# Altium schematic sheet MCU.SchDoc
size A2
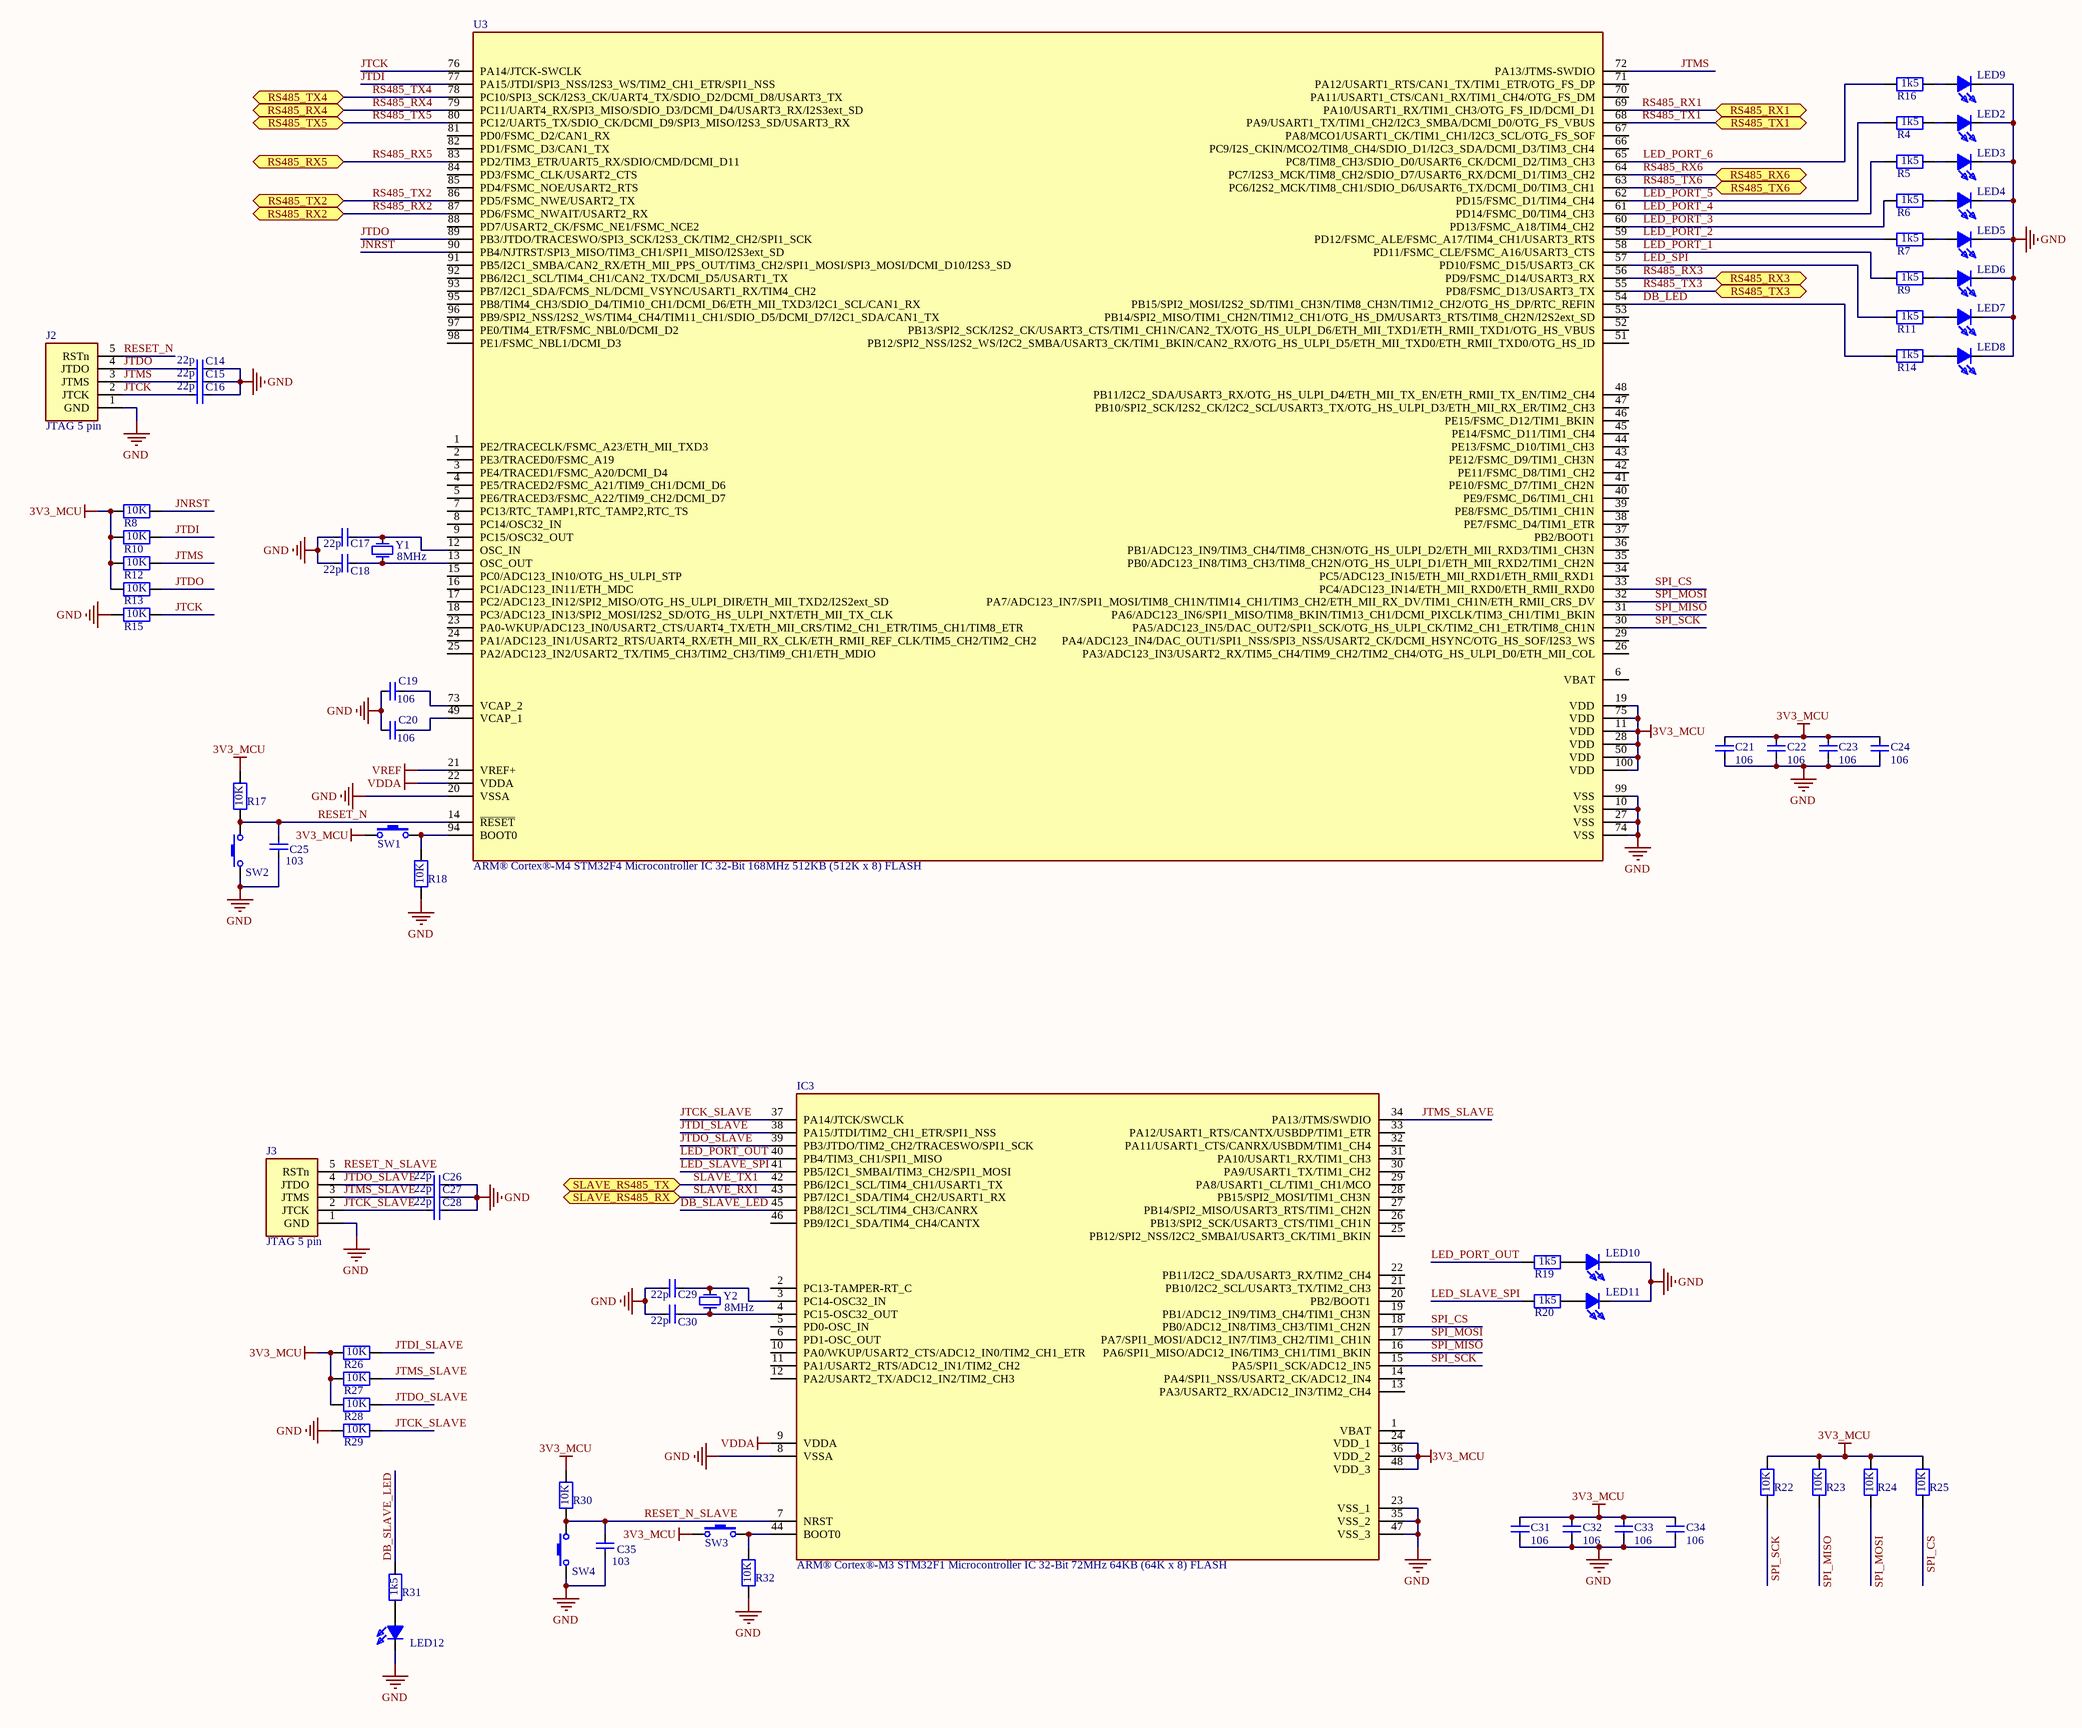
[diagram p0: MCU.SchDoc]

## Parts
C14  22p  [CAPC1608X95N]
C15  22p  [CAPC1608X95N]
C16  22p  [CAPC1608X95N]
C17  22p  [CAPC1608X95N]
C18  22p  [CAPC1608X95N]
C19  106  [CAPC1608X95N]
C20  106  [CAPC1608X95N]
C21  106  [CAPC1608X95N]
C22  106  [CAPC1608X95N]
C23  106  [CAPC1608X95N]
C24  106  [CAPC1608X95N]
C25  103  [CAPC1608X95N]
C26  22p  [CAPC1608X95N]
C27  22p  [CAPC1608X95N]
C28  22p  [CAPC1608X95N]
C29  22p  [CAPC1608X95N]
C30  22p  [CAPC1608X95N]
C31  106  [CAPC1608X95N]
C32  106  [CAPC1608X95N]
C33  106  [CAPC1608X95N]
C34  106  [CAPC1608X95N]
C35  103  [CAPC1608X95N]
IC3  ARM® Cortex®-M3 STM32F1 Microcontroller IC 32-Bit 72MHz 64KB (64K x 8) FLASH  [QFP50P900X900X160-48N]
J2  JTAG 5 pin  [HDRV5W66P0X254_1X5_1270X249X1067P]
J3  JTAG 5 pin  [HDRV5W66P0X254_1X5_1270X249X1067P]
LED2  LED0603_BLUE  [LEDC1608X80N]  (value not drawn)
LED3  LED0603_BLUE  [LEDC1608X80N]  (value not drawn)
LED4  LED0603_BLUE  [LEDC1608X80N]  (value not drawn)
LED5  LED0603_BLUE  [LEDC1608X80N]  (value not drawn)
LED6  LED0603_BLUE  [LEDC1608X80N]  (value not drawn)
LED7  LED0603_BLUE  [LEDC1608X80N]  (value not drawn)
LED8  LED0603_BLUE  [LEDC1608X80N]  (value not drawn)
LED9  LED0603_BLUE  [LEDC1608X80N]  (value not drawn)
LED10  LED0603_BLUE  [LEDC1608X80N]  (value not drawn)
LED11  LED0603_BLUE  [LEDC1608X80N]  (value not drawn)
LED12  LED0603_BLUE  [LEDC1608X80N]  (value not drawn)
R4  Res 0603 1k5  [RESC1608X55N]  (value not drawn)
R5  Res 0603 1k5  [RESC1608X55N]  (value not drawn)
R6  Res 0603 1k5  [RESC1608X55N]  (value not drawn)
R7  Res 0603 1k5  [RESC1608X55N]  (value not drawn)
R8  10k  [RESC1608X55N]  (value not drawn)
R9  Res 0603 1k5  [RESC1608X55N]  (value not drawn)
R10  10k  [RESC1608X55N]  (value not drawn)
R11  Res 0603 1k5  [RESC1608X55N]  (value not drawn)
R12  10k  [RESC1608X55N]  (value not drawn)
R13  10k  [RESC1608X55N]  (value not drawn)
R14  Res 0603 1k5  [RESC1608X55N]  (value not drawn)
R15  10k  [RESC1608X55N]  (value not drawn)
R16  Res 0603 1k5  [RESC1608X55N]  (value not drawn)
R17  10k  [RESC1608X55N]  (value not drawn)
R18  10k  [RESC1608X55N]  (value not drawn)
R19  Res 0603 1k5  [RESC1608X55N]  (value not drawn)
R20  Res 0603 1k5  [RESC1608X55N]  (value not drawn)
R22  10k  [RESC1608X55N]  (value not drawn)
R23  10k  [RESC1608X55N]  (value not drawn)
R24  10k  [RESC1608X55N]  (value not drawn)
R25  10k  [RESC1608X55N]  (value not drawn)
R26  10k  [RESC1608X55N]  (value not drawn)
R27  10k  [RESC1608X55N]  (value not drawn)
R28  10k  [RESC1608X55N]  (value not drawn)
R29  10k  [RESC1608X55N]  (value not drawn)
R30  10k  [RESC1608X55N]  (value not drawn)
R31  Res 0603 1k5  [RESC1608X55N]  (value not drawn)
R32  10k  [RESC1608X55N]  (value not drawn)
SW1  Switch SMD 2 pin  [RS282G05A3SMRT]  (value not drawn)
SW2  Switch SMD 2 pin  [RS282G05A3SMRT]  (value not drawn)
SW3  Switch SMD 2 pin  [RS282G05A3SMRT]  (value not drawn)
SW4  Switch SMD 2 pin  [RS282G05A3SMRT]  (value not drawn)
U3  ARM® Cortex®-M4 STM32F4 Microcontroller IC 32-Bit 168MHz 512KB (512K x 8) FLASH  [QFP50P1600X1600X160-100N]
Y1  8MHz  [F90800018Q]
Y2  8MHz  [F90800018Q]

## Ports
RS485_RX1 (bidir), RS485_RX2 (bidir), RS485_RX3 (bidir), RS485_RX4 (bidir), RS485_RX5 (bidir), RS485_RX6 (bidir), RS485_TX1 (bidir), RS485_TX2 (bidir), RS485_TX3 (bidir), RS485_TX4 (bidir), RS485_TX5 (bidir), RS485_TX6 (bidir), SLAVE_RS485_RX (bidir), SLAVE_RS485_TX (bidir)

## Nets
3V3_MCU: C21.2 C22.2 C23.2 C24.2 C31.2 C32.2 C33.2 C34.2 IC3.24(VDD_1) IC3.36(VDD_2) IC3.48(VDD_3) R8.1 R10.1 R12.1 R13.1 R17.2 R22.2 R23.2 R24.2 R25.2 R26.1 R27.1 R28.1 R30.2 SW1.P1(COM1) SW3.P1(COM1) U3.11(VDD) U3.19(VDD) U3.28(VDD) U3.50(VDD) U3.75(VDD) U3.100(VDD)
GND: C14.2 C15.2 C16.2 C17.1 C18.1 C19.1 C20.1 C21.1 C22.1 C23.1 C24.1 C25.1 C26.2 C27.2 C28.2 C29.1 C30.1 C31.1 C32.1 C33.1 C34.1 C35.1 IC3.8(VSSA) IC3.23(VSS_1) IC3.35(VSS_2) IC3.47(VSS_3) J2.1(GND) J3.1(GND) LED2.1(K) LED3.1(K) LED4.1(K) LED5.1(K) LED6.1(K) LED7.1(K) LED8.1(K) LED9.1(K) LED10.1(K) LED11.1(K) LED12.1(K) R15.1 R18.1 R29.1 R32.1 SW2.P1(COM1) SW4.P1(COM1) U3.10(VSS) U3.20(VSSA) U3.27(VSS) U3.74(VSS) U3.99(VSS)
VDDA: IC3.9(VDDA) U3.22(VDDA)
VREF: U3.21(VREF+)
DB_LED: R14.1 U3.54(PB15/SPI2_MOSI/I2S2_SD/TIM1_CH3N/TIM8_CH3N/TIM12_CH2/OTG_HS_DP/RTC_REFIN)
DB_SLAVE_LED: IC3.45(PB8/I2C1_SCL/TIM4_CH3/CANRX) R31.2
JNRST: R8.2 U3.90(PB4/NJTRST/SPI3_MISO/TIM3_CH1/SPI1_MISO/I2S3ext_SD)
JTCK: C16.1 J2.2(JTCK) R15.2 U3.76(PA14/JTCK-SWCLK)
JTCK_SLAVE: C28.1 IC3.37(PA14/JTCK/SWCLK) J3.2(JTCK) R29.2
JTDI: R10.2 U3.77(PA15/JTDI/SPI3_NSS/I2S3_WS/TIM2_CH1_ETR/SPI1_NSS)
JTDI_SLAVE: IC3.38(PA15/JTDI/TIM2_CH1_ETR/SPI1_NSS) R26.2
JTDO: C14.1 J2.4(JTDO) R13.2 U3.89(PB3/JTDO/TRACESWO/SPI3_SCK/I2S3_CK/TIM2_CH2/SPI1_SCK)
JTDO_SLAVE: C26.1 IC3.39(PB3/JTDO/TIM2_CH2/TRACESWO/SPI1_SCK) J3.4(JTDO) R28.2
JTMS: C15.1 J2.3(JTMS) R12.2 U3.72(PA13/JTMS-SWDIO)
JTMS_SLAVE: C27.1 IC3.34(PA13/JTMS/SWDIO) J3.3(JTMS) R27.2
LED_PORT_1: R9.1 U3.58(PD11/FSMC_CLE/FSMC_A16/USART3_CTS)
LED_PORT_2: R7.1 U3.59(PD12/FSMC_ALE/FSMC_A17/TIM4_CH1/USART3_RTS)
LED_PORT_3: R6.1 U3.60(PD13/FSMC_A18/TIM4_CH2)
LED_PORT_4: R5.1 U3.61(PD14/FSMC_D0/TIM4_CH3)
LED_PORT_5: R4.1 U3.62(PD15/FSMC_D1/TIM4_CH4)
LED_PORT_6: R16.1 U3.65(PC8/TIM8_CH3/SDIO_D0/USART6_CK/DCMI_D2/TIM3_CH3)
LED_PORT_OUT: IC3.40(PB4/TIM3_CH1/SPI1_MISO) R19.1
LED_SLAVE_SPI: IC3.41(PB5/I2C1_SMBAI/TIM3_CH2/SPI1_MOSI) R20.1
LED_SPI: R11.1 U3.57(PD10/FSMC_D15/USART3_CK)
RESET_N: C25.2 J2.5(RSTn) R17.1 SW2.T1(COM2) U3.14(~{RESET})
RESET_N_SLAVE: C35.2 IC3.7(NRST) J3.5(RSTn) R30.1 SW4.T1(COM2)
RS485_RX1: U3.69(PA10/USART1_RX/TIM1_CH3/OTG_FS_ID/DCMI_D1) ; port RS485_RX1
RS485_RX2: U3.87(PD6/FSMC_NWAIT/USART2_RX) ; port RS485_RX2
RS485_RX3: U3.56(PD9/FSMC_D14/USART3_RX) ; port RS485_RX3
RS485_RX4: U3.79(PC11/UART4_RX/SPI3_MISO/SDIO_D3/DCMI_D4/USART3_RX/I2S3ext_SD) ; port RS485_RX4
RS485_RX5: U3.83(PD2/TIM3_ETR/UART5_RX/SDIO/CMD/DCMI_D11) ; port RS485_RX5
RS485_RX6: U3.64(PC7/I2S3_MCK/TIM8_CH2/SDIO_D7/USART6_RX/DCMI_D1/TIM3_CH2) ; port RS485_RX6
RS485_TX1: U3.68(PA9/USART1_TX/TIM1_CH2/I2C3_SMBA/DCMI_D0/OTG_FS_VBUS) ; port RS485_TX1
RS485_TX2: U3.86(PD5/FSMC_NWE/USART2_TX) ; port RS485_TX2
RS485_TX3: U3.55(PD8/FSMC_D13/USART3_TX) ; port RS485_TX3
RS485_TX4: U3.78(PC10/SPI3_SCK/I2S3_CK/UART4_TX/SDIO_D2/DCMI_D8/USART3_TX) ; port RS485_TX4
RS485_TX5: U3.80(PC12/UART5_TX/SDIO_CK/DCMI_D9/SPI3_MISO/I2S3_SD/USART3_RX) ; port RS485_TX5
RS485_TX6: U3.63(PC6/I2S2_MCK/TIM8_CH1/SDIO_D6/USART6_TX/DCMI_D0/TIM3_CH1) ; port RS485_TX6
SLAVE_RX1: IC3.43(PB7/I2C1_SDA/TIM4_CH2/USART1_RX) ; port SLAVE_RS485_RX
SLAVE_TX1: IC3.42(PB6/I2C1_SCL/TIM4_CH1/USART1_TX) ; port SLAVE_RS485_TX
SPI_CS: IC3.18(PB0/ADC12_IN8/TIM3_CH3/TIM1_CH2N) R25.1 U3.33(PC4/ADC123_IN14/ETH_MII_RXD0/ETH_RMII_RXD0)
SPI_MISO: IC3.16(PA6/SPI1_MISO/ADC12_IN6/TIM3_CH1/TIM1_BKIN) R23.1 U3.31(PA6/ADC123_IN6/SPI1_MISO/TIM8_BKIN/TIM13_CH1/DCMI_PIXCLK/TIM3_CH1/TIM1_BKIN)
SPI_MOSI: IC3.17(PA7/SPI1_MOSI/ADC12_IN7/TIM3_CH2/TIM1_CH1N) R24.1 U3.32(PA7/ADC123_IN7/SPI1_MOSI/TIM8_CH1N/TIM14_CH1/TIM3_CH2/ETH_MII_RX_DV/TIM1_CH1N/ETH_RMII_CRS_DV)
SPI_SCK: IC3.15(PA5/SPI1_SCK/ADC12_IN5) R22.1 U3.30(PA5/ADC123_IN5/DAC_OUT2/SPI1_SCK/OTG_HS_ULPI_CK/TIM2_CH1_ETR/TIM8_CH1N)
NetC17_2: C17.2 U3.12(OSC_IN) Y1.1(CRYSTAL_1)
NetC18_2: C18.2 U3.13(OSC_OUT) Y1.2(CRYSTAL_2)
NetC19_2: C19.2 U3.73(VCAP_2)
NetC20_2: C20.2 U3.49(VCAP_1)
NetC29_2: C29.2 IC3.3(PC14-OSC32_IN) Y2.1(CRYSTAL_1)
NetC30_2: C30.2 IC3.4(PC15-OSC32_OUT) Y2.2(CRYSTAL_2)
NetIC3_44: IC3.44(BOOT0) R32.2 SW3.T1(COM2)
NetLED2_2: LED2.2(A) R4.2
NetLED3_2: LED3.2(A) R5.2
NetLED4_2: LED4.2(A) R6.2
NetLED5_2: LED5.2(A) R7.2
NetLED6_2: LED6.2(A) R9.2
NetLED7_2: LED7.2(A) R11.2
NetLED8_2: LED8.2(A) R14.2
NetLED9_2: LED9.2(A) R16.2
NetLED10_2: LED10.2(A) R19.2
NetLED11_2: LED11.2(A) R20.2
NetLED12_2: LED12.2(A) R31.1
NetR18_2: R18.2 SW1.T1(COM2) U3.94(BOOT0)

Not connected (* = marked no-connect by the designer): IC3 1(VBAT) 2(PC13-TAMPER-RT_C) 5(PD0-OSC_IN) 6(PD1-OSC_OUT) 10(PA0/WKUP/USART2_CTS/ADC12_IN0/TIM2_CH1_ETR) 11(PA1/USART2_RTS/ADC12_IN1/TIM2_CH2) 12(PA2/USART2_TX/ADC12_IN2/TIM2_CH3) 13(PA3/USART2_RX/ADC12_IN3/TIM2_CH4) 14(PA4/SPI1_NSS/USART2_CK/ADC12_IN4) 19(PB1/ADC12_IN9/TIM3_CH4/TIM1_CH3N) 20(PB2/BOOT1) 21(PB10/I2C2_SCL/USART3_TX/TIM2_CH3) 22(PB11/I2C2_SDA/USART3_RX/TIM2_CH4) 25(PB12/SPI2_NSS/I2C2_SMBAI/USART3_CK/TIM1_BKIN) 26(PB13/SPI2_SCK/USART3_CTS/TIM1_CH1N) 27(PB14/SPI2_MISO/USART3_RTS/TIM1_CH2N) 28(PB15/SPI2_MOSI/TIM1_CH3N) 29(PA8/USART1_CL/TIM1_CH1/MCO) 30(PA9/USART1_TX/TIM1_CH2) 31(PA10/USART1_RX/TIM1_CH3) 32(PA11/USART1_CTS/CANRX/USBDM/TIM1_CH4) 33(PA12/USART1_RTS/CANTX/USBDP/TIM1_ETR) 46(PB9/I2C1_SDA/TIM4_CH4/CANTX); U3 1(PE2/TRACECLK/FSMC_A23/ETH_MII_TXD3) 2(PE3/TRACED0/FSMC_A19) 3(PE4/TRACED1/FSMC_A20/DCMI_D4) 4(PE5/TRACED2/FSMC_A21/TIM9_CH1/DCMI_D6) 5(PE6/TRACED3/FSMC_A22/TIM9_CH2/DCMI_D7) 6(VBAT) 7(PC13/RTC_TAMP1,RTC_TAMP2,RTC_TS) 8(PC14/OSC32_IN) 9(PC15/OSC32_OUT) 15(PC0/ADC123_IN10/OTG_HS_ULPI_STP) 16(PC1/ADC123_IN11/ETH_MDC) 17(PC2/ADC123_IN12/SPI2_MISO/OTG_HS_ULPI_DIR/ETH_MII_TXD2/I2S2ext_SD) 18(PC3/ADC123_IN13/SPI2_MOSI/I2S2_SD/OTG_HS_ULPI_NXT/ETH_MII_TX_CLK) 23(PA0-WKUP/ADC123_IN0/USART2_CTS/UART4_TX/ETH_MII_CRS/TIM2_CH1_ETR/TIM5_CH1/TIM8_ETR) 24(PA1/ADC123_IN1/USART2_RTS/UART4_RX/ETH_MII_RX_CLK/ETH_RMII_REF_CLK/TIM5_CH2/TIM2_CH2) 25(PA2/ADC123_IN2/USART2_TX/TIM5_CH3/TIM2_CH3/TIM9_CH1/ETH_MDIO) 26(PA3/ADC123_IN3/USART2_RX/TIM5_CH4/TIM9_CH2/TIM2_CH4/OTG_HS_ULPI_D0/ETH_MII_COL) 29(PA4/ADC123_IN4/DAC_OUT1/SPI1_NSS/SPI3_NSS/USART2_CK/DCMI_HSYNC/OTG_HS_SOF/I2S3_WS) 34(PC5/ADC123_IN15/ETH_MII_RXD1/ETH_RMII_RXD1) 35(PB0/ADC123_IN8/TIM3_CH3/TIM8_CH2N/OTG_HS_ULPI_D1/ETH_MII_RXD2/TIM1_CH2N) 36(PB1/ADC123_IN9/TIM3_CH4/TIM8_CH3N/OTG_HS_ULPI_D2/ETH_MII_RXD3/TIM1_CH3N) 37(PB2/BOOT1) 38(PE7/FSMC_D4/TIM1_ETR) 39(PE8/FSMC_D5/TIM1_CH1N) 40(PE9/FSMC_D6/TIM1_CH1) 41(PE10/FSMC_D7/TIM1_CH2N) 42(PE11/FSMC_D8/TIM1_CH2) 43(PE12/FSMC_D9/TIM1_CH3N) 44(PE13/FSMC_D10/TIM1_CH3) 45(PE14/FSMC_D11/TIM1_CH4) 46(PE15/FSMC_D12/TIM1_BKIN) 47(PB10/SPI2_SCK/I2S2_CK/I2C2_SCL/USART3_TX/OTG_HS_ULPI_D3/ETH_MII_RX_ER/TIM2_CH3) 48(PB11/I2C2_SDA/USART3_RX/OTG_HS_ULPI_D4/ETH_MII_TX_EN/ETH_RMII_TX_EN/TIM2_CH4) 51(PB12/SPI2_NSS/I2S2_WS/I2C2_SMBA/USART3_CK/TIM1_BKIN/CAN2_RX/OTG_HS_ULPI_D5/ETH_MII_TXD0/ETH_RMII_TXD0/OTG_HS_ID) 52(PB13/SPI2_SCK/I2S2_CK/USART3_CTS/TIM1_CH1N/CAN2_TX/OTG_HS_ULPI_D6/ETH_MII_TXD1/ETH_RMII_TXD1/OTG_HS_VBUS) 53(PB14/SPI2_MISO/TIM1_CH2N/TIM12_CH1/OTG_HS_DM/USART3_RTS/TIM8_CH2N/I2S2ext_SD) 66(PC9/I2S_CKIN/MCO2/TIM8_CH4/SDIO_D1/I2C3_SDA/DCMI_D3/TIM3_CH4) 67(PA8/MCO1/USART1_CK/TIM1_CH1/I2C3_SCL/OTG_FS_SOF) 70(PA11/USART1_CTS/CAN1_RX/TIM1_CH4/OTG_FS_DM) 71(PA12/USART1_RTS/CAN1_TX/TIM1_ETR/OTG_FS_DP) 81(PD0/FSMC_D2/CAN1_RX) 82(PD1/FSMC_D3/CAN1_TX) 84(PD3/FSMC_CLK/USART2_CTS) 85(PD4/FSMC_NOE/USART2_RTS) 88(PD7/USART2_CK/FSMC_NE1/FSMC_NCE2) 91(PB5/I2C1_SMBA/CAN2_RX/ETH_MII_PPS_OUT/TIM3_CH2/SPI1_MOSI/SPI3_MOSI/DCMI_D10/I2S3_SD) 92(PB6/I2C1_SCL/TIM4_CH1/CAN2_TX/DCMI_D5/USART1_TX) 93(PB7/I2C1_SDA/FCMS_NL/DCMI_VSYNC/USART1_RX/TIM4_CH2) 95(PB8/TIM4_CH3/SDIO_D4/TIM10_CH1/DCMI_D6/ETH_MII_TXD3/I2C1_SCL/CAN1_RX) 96(PB9/SPI2_NSS/I2S2_WS/TIM4_CH4/TIM11_CH1/SDIO_D5/DCMI_D7/I2C1_SDA/CAN1_TX) 97(PE0/TIM4_ETR/FSMC_NBL0/DCMI_D2) 98(PE1/FSMC_NBL1/DCMI_D3)

## Notes on the sheet
- (in symbol Res 0603 1k5) 1k5
- (in symbol Res 0603 10k) 10K

## Library data of the parts
C14-C18 C26-C30 = Cap 0603 22pF: 22 pF ±5% 50V Ceramic Capacitor C0G, NP0 0603 (1608 Metric); Manufacturer_Name: KEMET; Manufacturer_Part_Number: CC0603JRNPO9BN220; Datasheet Link: http://componentsearchengine.com/Datasheets/1/CC0603JRNPO9BN220.pdf; Mouser Part Number: 603-CC603JRNPO9BN220; Mouser Price/Stock: https://www.mouser.co.uk/ProductDetail/YAGEO/CC0603JRNPO9BN220?qs=vTakOoo5QyIVMYOUTI%2F4zA%3D%3D; Arrow Part Number: CC0603JRNPO9BN220; Arrow Price/Stock: https://www.arrow.com/en/products/cc0603jrnpo9bn220/yageo?region=nac
C19-C24 C31-C34 = Cap 106 - 0603: Cap 10uF 10v 0603 SMD 10% X7R Phycomp 10nF Multilayer Ceramic Capacitor (MLCC) 10 V dc +/-10% X7R dielectric Standard max op. temp. +125C; Manufacturer_Name: Murata Electronics; Manufacturer_Part_Number: GRM188D71A106KA73D; Datasheet Link: https://psearch.en.murata.com/capacitor/product/GRM188D71A106KA73%23.html; Height: 0.9mm; Mouser Part Number: 81-GRM188D71A106KA3D; Mouser Price/Stock: https://www.mouser.co.uk/ProductDetail/Murata-Electronics/GRM188D71A106KA73D?qs=FvQ4nYu%252B2He2GIhYKxXmMQ%3D%3D; Arrow Part Number: GRM188D71A106KA73D; Arrow Price/Stock: https://www.arrow.com/en/products/grm188d71a106ka73d/murata-manufacturing?region=nac
C25 C35 = Cap 103 - 0603: Cap 10nF 50v 0603 SMD 10% X7R Phycomp 10nF Multilayer Ceramic Capacitor (MLCC) 50 V dc +/-10% X7R dielectric Standard max op. temp. +125C; Manufacturer_Name: KEMET; Manufacturer_Part_Number: CC0603KRX7R9BB103; Datasheet Link: https://datasheet.datasheetarchive.com/originals/distributors/Datasheets_SAMA/d9f127a4875522309d99aa7dec79633c.pdf; Height: 0.9mm; Mouser Part Number: 603-CC603KRX7R9BB103; Mouser Price/Stock: https://www.mouser.co.uk/ProductDetail/YAGEO/CC0603KRX7R9BB103?qs=AgBp2OyFlx%252BeoRRspw6PJg%3D%3D; Arrow Part Number: CC0603KRX7R9BB103; Arrow Price/Stock: https://www.arrow.com/en/products/cc0603krx7r9bb103/yageo?region=nac
IC3 = STM32F103C8T6TR: Manufacturer_Name: STMicroelectronics; Datasheet Link: http://media.digikey.com/pdf/Data%20Sheets/ST%20Microelectronics%20PDFS/STM32F103x8,B.pdf; Height: 1.6mm; Manufacturer_Part_Number: STM32F103C8T6TR; Mouser Part Number: 511-STM32F103C8T6TR; Mouser Price/Stock: https://www.mouser.co.uk/ProductDetail/STMicroelectronics/STM32F103C8T6TR?qs=5HwTSiuA5HDxFj62n06yag%3D%3D; Arrow Part Number: STM32F103C8T6TR; Arrow Price/Stock: https://www.arrow.com/en/products/stm32f103c8t6tr/stmicroelectronics?region=nac
J2 J3 = JTAG 5 pin: Headers & Wire Housings 5P HEADER 15u Au; Manufacturer_Name: Molex; Datasheet Link: https://www.mouser.com/datasheet/2/276/0022284054_PCB_HEADERS-228201.pdf; Height: 10.67mm; Manufacturer_Part_Number: 22-28-4054; Mouser Part Number: 538-22-28-4054; Mouser Price/Stock: https://www.mouser.com/Search/Refine.aspx?Keyword=538-22-28-4054
LED2-LED12 = LED0603_BLUE: LED; Manufacturer_Name: Wurth Elektronik; Manufacturer_Part_Number: 150060BS75000; Datasheet Link: https://componentsearchengine.com/Datasheets/2/150060BS75000.pdf; Height: 0.8mm; Mouser Part Number: 710-150060BS75000; Mouser Price/Stock: https://www.mouser.co.uk/ProductDetail/Wurth-Elektronik/150060BS75000?qs=LlUlMxKIyB2DLLpXQThavA%3D%3D
R4-R7 R9 R11 R14 R16 R19 R20 R31 = Res 0603 1k5: Thick Film Resistors - SMD 1.5 kOhms 100mW 0603 1%; Manufacturer_Name: KEMET; Manufacturer_Part_Number: RC0603FR-071K5L; Datasheet Link: http://www.yageo.com/documents/recent/PYu-RC0603_51_RoHS_L_v5.pdf; Height: 0.55mm; Mouser Part Number: 603-RC0603FR-071K5L; Mouser Price/Stock: https://www.mouser.co.uk/ProductDetail/YAGEO/RC0603FR-071K5L?qs=VU8sRB4EgwBMt9nc4XGNgA%3D%3D; Arrow Part Number: RC0603FR-071K5L; Arrow Price/Stock: https://www.arrow.com/en/products/rc0603fr-071k5l/yageo?region=nac
R8 R10 R12 R13 R15 R17 R18 R22-R30 R32 = Res 0603 10k: Resistor 10 kOhms ±1% 0.1W, 1/10W Chip Resistor 0603 (1608 Metric) Automotive AEC-Q200 Thick Film; Manufacturer_Name: Panasonic; Manufacturer_Part_Number: ERJ-3EKF1002V; Datasheet Link: http://industrial.panasonic.com/cdbs/www-data/pdf/RDA0000/AOA0000C86.pdf; Height: 0.55mm; Mouser Part Number: 667-ERJ-3EKF1002V; Mouser Price/Stock: https://www.mouser.co.uk/ProductDetail/Panasonic/ERJ-3EKF1002V?qs=H7k1u0Mp9JSrGPQ5%2F5COuw%3D%3D; Arrow Part Number: ERJ-3EKF1002V; Arrow Price/Stock: https://www.arrow.com/en/products/erj-3ekf1002v/panasonic?region=europe
SW1-SW4 = Switch SMD 2 pin: SWITCH TACTILE SPST-NO 0.05A 12V; Manufacturer_Name: C & K COMPONENTS; Manufacturer_Part_Number: RS-282G05A3-SM RT; Datasheet Link: https://media.digikey.com/pdf/Data%20Sheets/C&K/RS-282G05A-SM_RT.pdf; Height: 2.5mm; Mouser Part Number: 611-RS-282G05A3-SMRT; Mouser Price/Stock: https://www.mouser.com/Search/ProductDetail.aspx?qs=T%252bgPUmif8%252bjtyA9QuPnoeg%3d%3d
U3 = STM32F407VET6: Manufacturer_Name: STMicroelectronics; Datasheet Link: http://www.st.com/web/en/resource/technical/document/datasheet/DM00037051.pdf; Height: 1.6mm; Manufacturer_Part_Number: STM32F407VET6; Mouser Part Number: 511-STM32F407VET6; Mouser Price/Stock: https://www.mouser.co.uk/ProductDetail/STMicroelectronics/STM32F407VET6?qs=Z8%252BeY1k3TIJFAMMqSR%252BGtw%3D%3D; Arrow Part Number: STM32F407VET6; Arrow Price/Stock: https://www.arrow.com/en/products/stm32f407vet6/stmicroelectronics?region=nac
Y1 Y2 = XTAL 8MHz: Crystal 8Mhz SMD 5032 2 pin; Manufacturer_Name: Diodes Incorporated; Datasheet Link: https://media.digikey.com/pdf/Data%20Sheets/Pericom%20PDFs/F90800018Q_A.pdf; Height: 1.35mm; Manufacturer_Part_Number: F90800018Q; Mouser Part Number: 729-F90800018Q; Mouser Price/Stock: https://www.mouser.com/Search/Refine.aspx?Keyword=729-F90800018Q; Arrow Part Number: F90800018Q; Arrow Price/Stock: https://www.arrow.com/en/products/f90800018q/diodes-incorporated